# Altium project LMP91000 BLE.PrjPcb
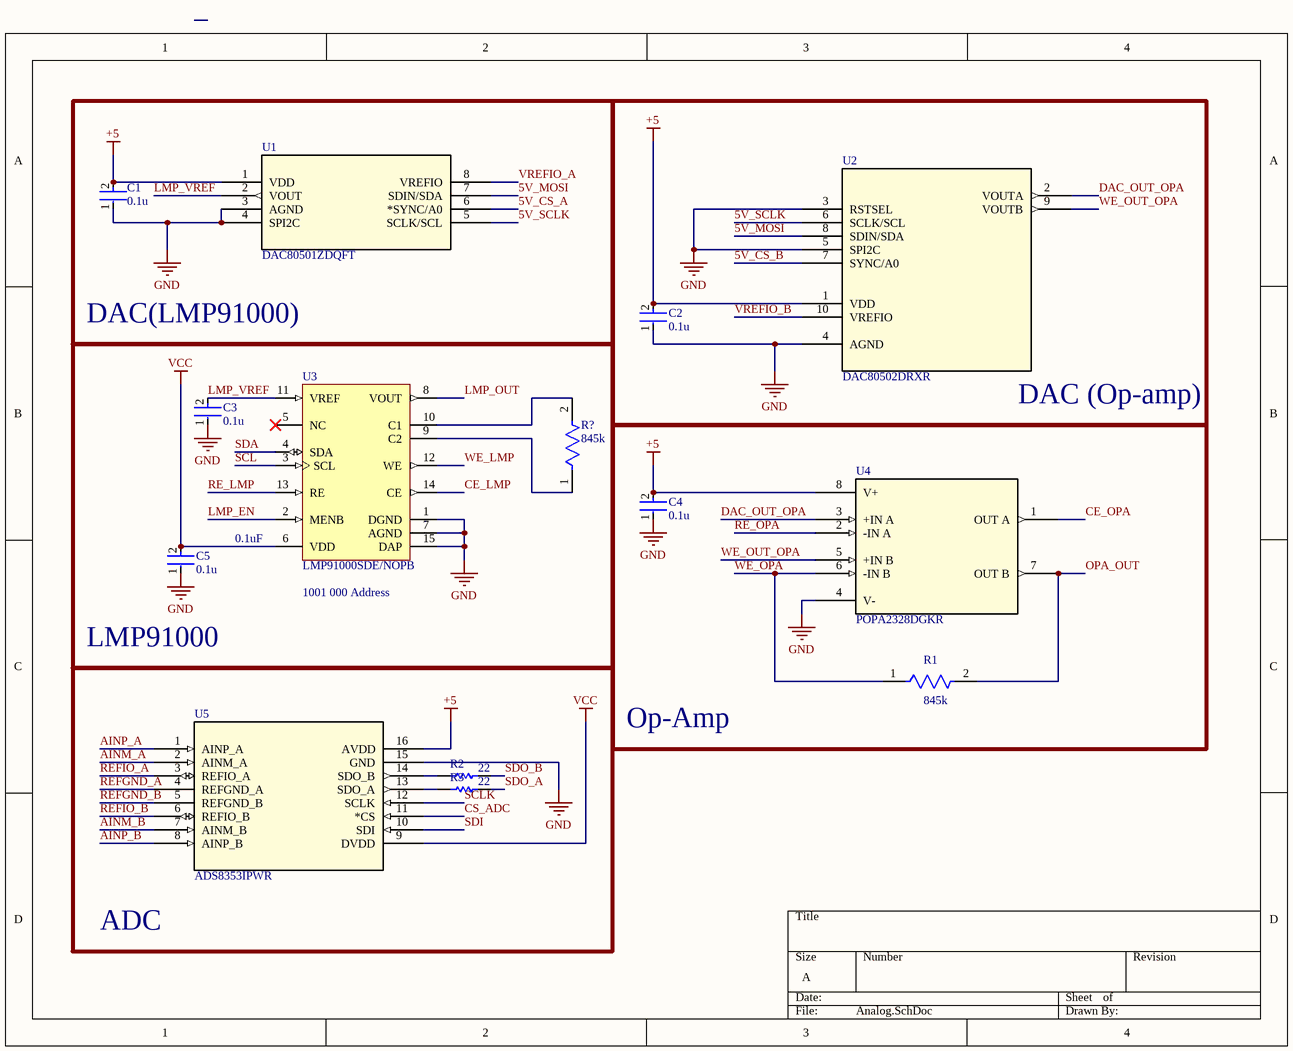
[diagram p0: Analog.SchDoc]
3 sheets, 34 parts. Net scope: global (net labels, ports and power ports of the same name join across sheets).
Board file: LMP91000 BLE.PcbDoc
Sheets:
  Analog.SchDoc
  MCU.SchDoc
  Power.SchDoc

## Sheet Analog.SchDoc
size A; SheetNumber: 1; SheetTotal: 4

### Parts
C1  0.1u  [FP-GCJ188-0_2-IPC_C]
C2  0.1u  [FP-GCJ188-0_2-IPC_C]
C3  0.1u  [FP-GCJ188-0_2-IPC_C]
C4  0.1u  [FP-GCJ188-0_2-IPC_C]
C5  0.1u  [FP-GCJ188-0_2-IPC_C]
R1  845k  [FP-CR0603-IPC_B]
R2  22  [RESC1608X55X25LL10T15]
R3  22  [RESC1608X55X25LL10T15]
R?  845k  [FP-CR0603-IPC_B]
U1  DAC80501ZDQFT  [WSON8_2P1X2P1_TEX]
U2  DAC80502DRXR  [SON_02DRXR_TEX]
U3  LMP91000SDE/NOPB  [NHL0014B_V]
U4  POPA2328DGKR  [SO8_DGK_TEX]
U5  ADS8353IPWR  [PW16_TEX]

### Blocks framed on the sheet
DAC(LMP91000): C1 U1
DAC (Op-amp): C2 U2
LMP91000: C3 C5 R? U3
Op-Amp: C4 R1 U4

### Nets
+5: C1.2 C2.2 C4.2 U1.1(VDD) U2.1(VDD) U4.8(V+) U5.16(AVDD)
GND: C1.1 C2.1 C3.1 C4.1 C5.1 U1.3(AGND) U1.4(SPI2C) U2.3(RSTSEL) U2.4(AGND) U2.5(SPI2C) U3.1(DGND) U3.7(AGND) U3.15(DAP) U4.4(V-) U5.15(GND)
VCC: C5.2 U3.6(VDD) U5.9(DVDD)
5V_CS_A: U1.6(*SYNC/A0)
5V_CS_B: U2.7(SYNC/A0)
5V_MOSI: U1.7(SDIN/SDA) U2.8(SDIN/SDA)
5V_SCLK: U1.5(SCLK/SCL) U2.6(SCLK/SCL)
AINM_A: U5.2(AINM_A)
AINM_B: U5.7(AINM_B)
AINP_A: U5.1(AINP_A)
AINP_B: U5.8(AINP_B)
CE_LMP: U3.14(CE)
CE_OPA: U4.1(OUT_A)
CS_ADC: U5.11(*CS)
DAC_OUT_OPA: U2.2(VOUTA) U4.3(+IN_A)
LMP_EN: U3.2(MENB)
LMP_OUT: U3.8(VOUT)
LMP_VREF: C3.2 U1.2(VOUT) U3.11(VREF)
OPA_OUT: R1.2 U4.7(OUT_B)
RE_LMP: U3.13(RE)
RE_OPA: U4.2(-IN_A)
REFGND_A: U5.4(REFGND_A)
REFGND_B: U5.5(REFGND_B)
REFIO_A: U5.3(REFIO_A)
REFIO_B: U5.6(REFIO_B)
SCL: U3.3(SCL)
SCLK: U5.12(SCLK)
SDA: U3.4(SDA)
SDI: U5.10(SDI)
SDO_A: R3.2
SDO_B: R2.2
VREFIO_A: U1.8(VREFIO)
VREFIO_B: U2.10(VREFIO)
WE_LMP: U3.12(WE)
WE_OPA: R1.1 U4.6(-IN_B)
WE_OUT_OPA: U2.9(VOUTB) U4.5(+IN_B)
NetR2_1: R2.1 U5.14(SDO_B)
NetR3_1: R3.1 U5.13(SDO_A)
NetR?_1: R?.1 U3.9(C2)
NetR?_2: R?.2 U3.10(C1)

Not connected (* = marked no-connect by the designer): U3 5(NC)*

### Notes on the sheet
- 0.1uF
- (near U3) 1001 000 Address
- ADC

### Library data of the parts
C1-C5 = CMP-2006-02223-2: Cap Ceramic 0.1uF 50V X7R 10% Pad SMD 0603 Soft Termination +125°C Automotive T/R; Capacitance: 100nF; Radiation Hardening: No; Dielectric: X7R; Voltage Rating (DC): 50V; Case Code (Imperial): 0603; Length: 1.6mm; Features: Soft Termination; Case Code (Metric): 1608; Case/Package: 0603; Termination: SMD/SMT; Packaging: Tape and Reel; Height: 0.8mm; Tolerance: 10%; Thickness: 0.035inch; Width: 0.031inch; Voltage Rating: 50V; Min Operating Temperature: -55°C; Ratings: AEC-Q200; Package Quantity: 1; Depth: 0.8mm; Mount: Surface Mount; Lead Free: Lead Free; Max Operating Temperature: 125°C
R1 R? = CMP-07231-001938-1: Thick Film Chip Resistors 0603 845kΩ 0.1W 1% 100ppm/°C; Voltage Rating: 50V; Power Rating: 100mW; Resistance: 845kR; Contact Plating: Tin; Case/Package: 0603; Tolerance: 1%; Case Code (Metric): 1608; Termination: SMD/SMT; Min Operating Temperature: -55°C; Depth: 0.8mm; Mount: Surface Mount; Max Operating Temperature: 155°C; Thickness: 457um; Military Standard: Not; Height: 0.45mm; Radiation Hardening: No; Length: 1.6mm; Temperature Coefficient: 100ppm/°C; Case Code (Imperial): 0603; Package Quantity: 5000; Width: 0.8mm; Composition: Thick Film; Packaging: Tape and Reel
R2 R3 = CMP-2000-04180-1: Manufacturer: Yageo; Part Number: RC0603FR-1022RL
U1 = DAC80501ZDQFT: True 16-bit, 1-ch, SPI/I2C, voltage-output DAC in WSON package with precision internal reference; Mfr_Name: Texas Instruments; RefDes: RefDes; Type: Type; Supplier 1: Mouser; Supplier Part Number 1: 595-DAC80501ZDQFT
U2 = DAC80502DRXR: Dual-channel, 1-LSB INL, 16-bit, SPI voltage-output digital-to-analog converter (DAC); Mfr_Name: Texas Instruments; RefDes: RefDes; Type: Type; Supplier 1: Digikey; Supplier Part Number 1: 296-DAC80502DRXTCT-ND
U3 = CMP-0064-00201-2: Configurable AFE Potentiostat for Low-Power Chemical Sensing Applications, 14-pin LLP, 250 Reel; Manufacturer: Texas Instruments; PowerWise: N; PackageTopMarking: NS*UZXYTT*L91000; CompType: OtherParts; PackageDescription: LLP, Plastic, Dual, 4 x 4 x 0.8mm Body, 14 Lead, 0.5mm Pitch, No Pullback; ComponentLink1URL: http://www.ti.com/general/docs/lit/getliterature.tsp?genericPartNumber=LMP91000&fileType=pdf; ComponentLink1Description: Datasheet URL; PinCount: 14; RoHS: Y; PackageReference: NHL0014B
U4 = POPA2328DGKR: Dual-channel, precision, 50-µV offset voltage, 40-MHz wide-bandwidth RRIO CMOS op amp; Mfr_Name: Texas Instruments; RefDes: RefDes; Type: Type; Supplier 1: Mouser; Supplier Part Number 1: 595-OPA2328DGKR
U5 = ADS8353IPWR: 16-bit 600-kSPS 2-channel simultaneous-sampling SAR ADC with single-ended inputs; Mfr_Name: Texas Instruments; RefDes: RefDes; Type: Type; Supplier 1: Mouser; Supplier Part Number 1: 595-ADS8353IPWR

## Sheet MCU.SchDoc
size A; SheetNumber: 2; SheetTotal: 4
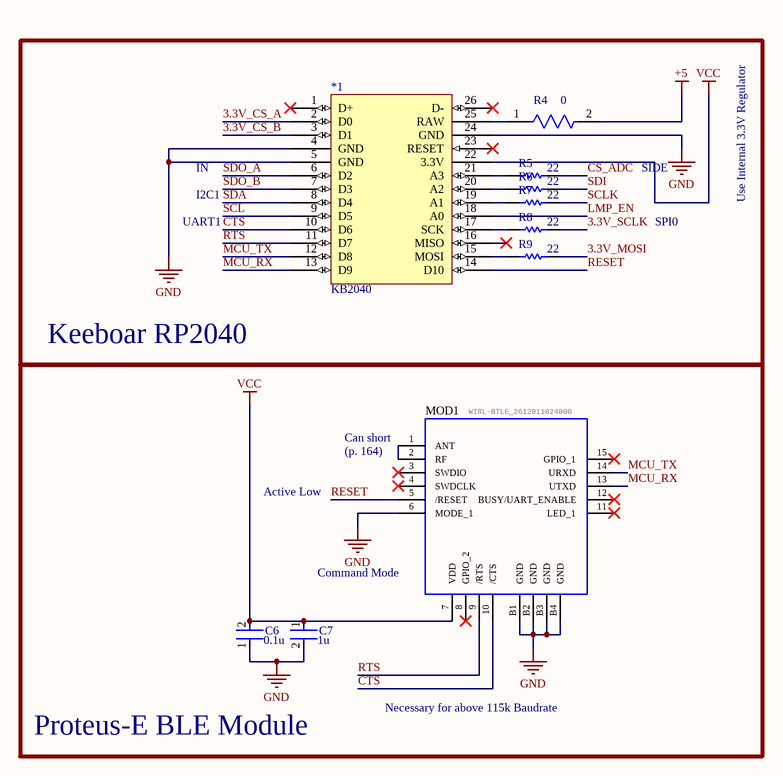
[diagram p1: MCU.SchDoc]

### Parts
*1  KB2040  [CAC-254P3300X1775-26N]
C6  0.1u  [FP-GCJ188-0_2-IPC_C]
C7  1u  [FP-GCM188-0_1-IPC_B]
MOD1  WIRL-BTLE_2612011024000  [WE-FP-6]
R4  0  [FP-CRCW0603-MFG]
R5  22  [RESC1608X55X25LL10T15]
R6  22  [RESC1608X55X25LL10T15]
R7  22  [RESC1608X55X25LL10T15]
R8  22  [RESC1608X55X25LL10T15]
R9  22  [RESC1608X55X25LL10T15]

### Blocks framed on the sheet
Keeboar RP2040: *1 R4-R9
Proteus-E BLE Module: C6 C7 MOD1

### Nets
+5: R4.2
GND: *1.4(GND) *1.5(GND) *1.24(GND) C6.1 C7.2 MOD1.6(MODE_1) MOD1.B1(GND) MOD1.B2(GND) MOD1.B3(GND) MOD1.B4(GND)
VCC: *1.22(3.3V) C6.2 C7.1 MOD1.7(VDD)
3.3V_CS_A: *1.2(D0)
3.3V_CS_B: *1.3(D1)
3.3V_MOSI: R9.2
3.3V_SCLK: R8.2
CS_ADC: R5.2
CTS: *1.10(D6) MOD1.10(/CTS)
LMP_EN: *1.18(A0)
MCU_RX: *1.13(D9) MOD1.13(UTXD)
MCU_TX: *1.12(D8) MOD1.14(URXD)
RESET: *1.14(D10) MOD1.5(/RESET)
RTS: *1.11(D7) MOD1.9(/RTS)
SCL: *1.9(D5)
SCLK: R7.2
SDA: *1.8(D4)
SDI: R6.2
SDO_A: *1.6(D2)
SDO_B: *1.7(D3)
Net*1_15: *1.15(MOSI) R9.1
Net*1_17: *1.17(SCK) R8.1
Net*1_19: *1.19(A1) R7.1
Net*1_20: *1.20(A2) R6.1
Net*1_21: *1.21(A3) R5.1
Net*1_25: *1.25(RAW) R4.1
NetMOD1_1: MOD1.1(ANT) MOD1.2(RF)

Not connected (* = marked no-connect by the designer): *1 1(D+)* 16(MISO)* 23(RESET)* 26(D-)*; MOD1 3(SWDIO)* 4(SWDCLK)* 8(GPIO_2)* 11(LED_1)* 12(BUSY/UART_ENABLE)* 15(GPIO_1)*

### Notes on the sheet
- IN
- I2C1
- SIDE
- Use Internal 3.3V Regulator
- UART1
- SPI0
- (near MOD1) Can short
- (near MOD1) (p. 164)
- Active Low
- Command Mode
- Necessary for above 115k Baudrate

### Library data of the parts
*1 = KB2040-1: Adafruit KB2040 - RP2040 Kee Boar Driver; Adafruit Link: https://www.adafruit.com/product/5302#technical-details
C6 = CMP-2006-02223-2: as C1 on sheet Analog; Radiation Hardening: No; Dielectric: X7R; Voltage Rating (DC): 50V; Case Code (Imperial): 0603; Length: 1.6mm; Features: Soft Termination; Case Code (Metric): 1608; Case/Package: 0603; Termination: SMD/SMT; Packaging: Tape and Reel; Height: 0.8mm; Tolerance: 10%; Thickness: 0.035inch; Width: 0.031inch; Voltage Rating: 50V; Min Operating Temperature: -55°C; Ratings: AEC-Q200; Package Quantity: 1; Depth: 0.8mm; Mount: Surface Mount; Lead Free: Lead Free; Max Operating Temperature: 125°C
C7 = CMP-2006-02357-2: Ceramic Capacitor for Automotive 1uF  ±10% 16VDC X7R 0603 Paper T/R; Voltage: 16V; Thickness: 0.035inch; Width: 0.031inch; Radiation Hardening: No; Depth: 0.8mm; Max Operating Temperature: 125°C; Package Quantity: 1; Ratings: AEC-Q200; Min Operating Temperature: -55°C; Packaging: Tape and Reel; Case Code (Metric): 1608; REACH SVHC: No SVHC; Dielectric: X7R; Case Code (Imperial): 0603; Length: 1.6mm; Height: 0.8mm; Voltage Rating: 16V; Termination: SMD/SMT; Case/Package: 0603; Voltage Rating (DC): 16V; Tolerance: 10%; Capacitance: 1uF; Mount: Surface Mount; Lead Free: Lead Free
MOD1 = WIRL-BTLE_2612011024000: Proteus-e Bluetooth® LE 5.1 Module; RX sensitivity e.r.p: -85; Line of Sight: 350m; Frequency: 2402-2480MHz; Output Power e.r.p: -4dBm; Operating Supply Voltage max.: 3.6V; Operating Supply Voltage min.: 1.8V; Part Number: 2612011024000; Published Date: Jan 2022; Publisher: Würth Elektronik; Operating Temperature: -40 to +85degC; Mounting technology: SMT; Packaging: Tape and reel; ComponentLink1Description: Manufacturer; ComponentLink1URL: http://www.we-online.de; ComponentLink2Description: Datasheet; ComponentLink2URL: https://katalog.we-online.de/wco/datasheet/2612011024000.pdf; Supplier 1: Digikey; Supplier Part Number 1: 732-2612011024000CT-ND
R4 = CMP-02407-011577-1: RES SMD 0 OHM JUMPER 1/10W 0603; Resistance: 0R; Tolerance: 5%; Power Dissipation: 100mW; Voltage Rating (DC): 75V; Temperature Coefficient: 100ppm/°C; Min Operating Temperature: -55°C; RoHS Compliant: No; Military Standard: Not; Case Code (Imperial): 0603; Series: CRCW; Resistor Type: Thick Film; Features: Automotive AEC-Q200; Power Rating: 100mW; Radiation Hardening: No; Case/Package: 0603; Width: 0.033inch; Length: 1.55mm; Case Code (Metric): 1608; Depth: 0.85mm; Package Quantity: 5000; Size Code: 0603; Weight: 7.1E-05oz; Termination: SMD/SMT; Lead Free: Contains Lead; Packaging: Tape and Reel; Contact Plating: Tin; Max Operating Temperature: 155°C; Number of Terminations: 2; Max Power Dissipation: 100mW; Construction: Rectangular; Mount: Surface Mount; Height: 0.02inch; Voltage Rating: 75V
R5-R9 = CMP-2000-04180-1: as R2 on sheet Analog

## Sheet Power.SchDoc
size A; SheetNumber: 3; SheetTotal: 4
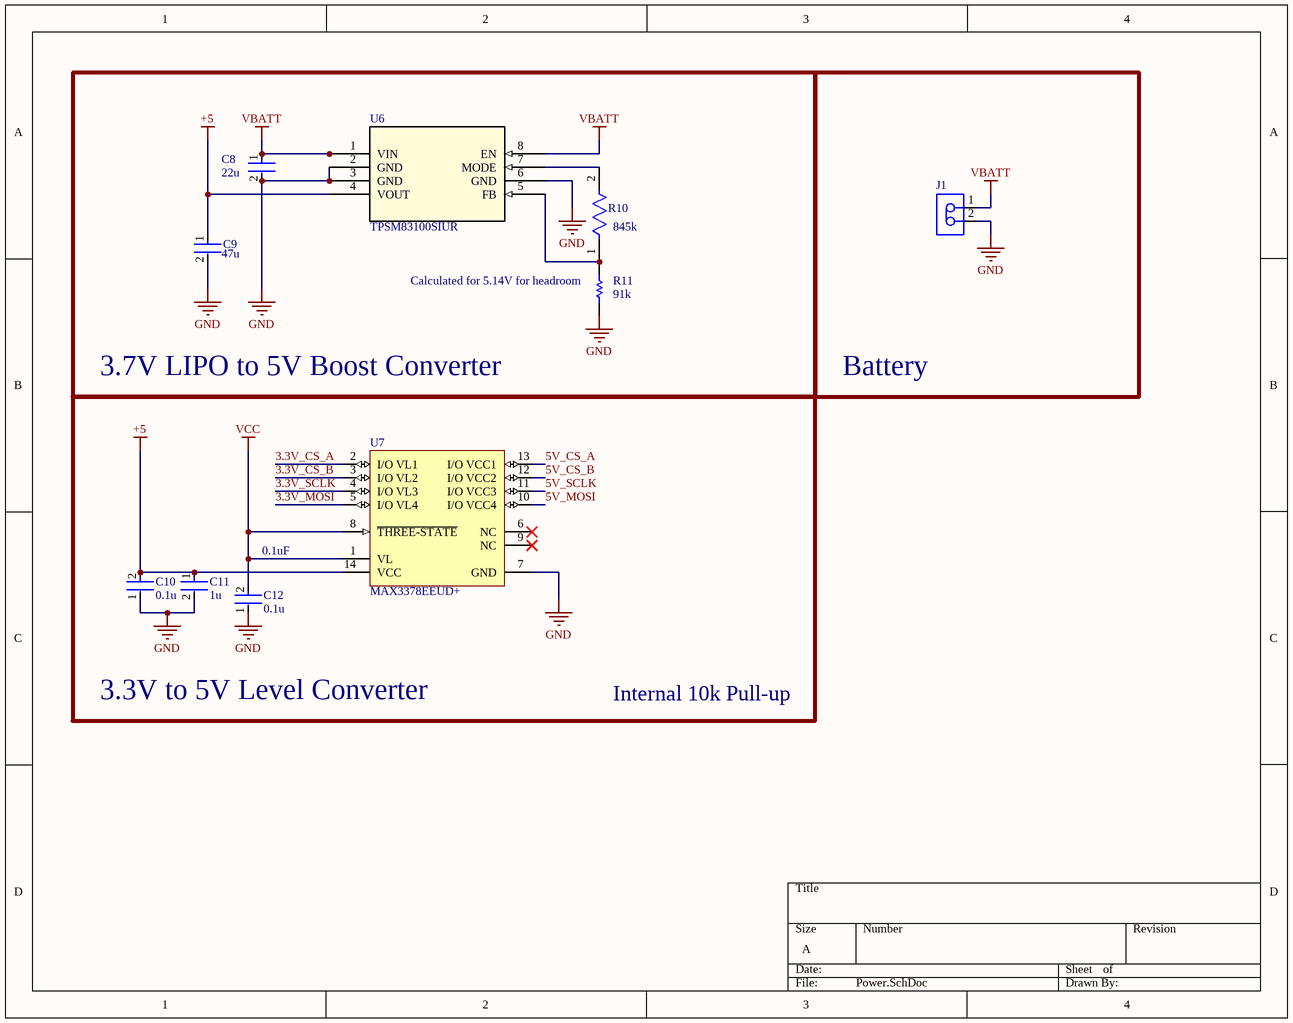
[diagram p2: Power.SchDoc]

### Parts
C8  22u  [FP-GRM187-0_2-IPC_C]
C9  47u  [FP-GRM219-0_2-0_1-IPC_A]
C10  0.1u  [FP-GCJ188-0_2-IPC_C]
C11  1u  [FP-GCM188-0_1-IPC_B]
C12  0.1u  [FP-GCJ188-0_2-IPC_C]
J1  B2B-PH-K-S(LF)(SN)  [JST-B2B-PH-K-S_V]  (value not drawn)
R10  845k  [FP-CR0603-IPC_B]
R11  91k  [RESC1609X50X30NL10T20]
U6  TPSM83100SIUR  [MICROSIP8_SIU_TEX]
U7  MAX3378EEUD+  [MAXM-U14+1_V]

### Blocks framed on the sheet
3.7V LIPO to 5V Boost Converter: C8 C9 R10 R11 U6
Battery: J1
3.3V to 5V Level Converter: C10-C12 U7

### Nets
+5: C9.1 C10.2 C11.1 U6.4(VOUT) U7.14(VCC)
GND: C8.2 C9.2 C10.1 C11.2 C12.1 J1.2 R11.1 U6.2(GND) U6.3(GND) U6.6(GND) U7.7(GND)
VBATT: C8.1 J1.1 U6.1(VIN) U6.8(EN)
VCC: C12.2 U7.1(VL) U7.8(~{THREE-STATE})
3.3V_CS_A: U7.2(I/O_VL1)
3.3V_CS_B: U7.3(I/O_VL2)
3.3V_MOSI: U7.5(I/O_VL4)
3.3V_SCLK: U7.4(I/O_VL3)
5V_CS_A: U7.13(I/O_VCC1)
5V_CS_B: U7.12(I/O_VCC2)
5V_MOSI: U7.10(I/O_VCC4)
5V_SCLK: U7.11(I/O_VCC3)
NetR10_1: R10.1 R11.2 U6.5(FB)
NetR10_2: R10.2 U6.7(MODE)

Not connected (* = marked no-connect by the designer): U7 6(NC)* 9(NC)*

### Notes on the sheet
- (near R11) Calculated for 5.14V for headroom
- (near C12) 0.1uF
- Internal 10k Pull-up

### Library data of the parts
C8 = CMP-06035-049226-1: Chip Multilayer Ceramic Capacitors for General Purpose, 0603, 22uF, X5R, 15%, 20%, 10V; Dielectric: X5R; Capacitance: 22uF; Voltage Rating: 10V; Case/Package: 0603; Case Code (Imperial): 0603; Voltage Rating (DC): 10V; Mount: Surface Mount; Length: 0.063inch; Width: 0.031inch; Max Operating Temperature: 85°C; Thickness: 0.031inch; Tolerance: 20%; Case Code (Metric): 1608; Packaging: Tape and Reel; Min Operating Temperature: -55°C
C9 = CMP-06035-004086-1: Chip Multilayer Ceramic Capacitors for General Purpose, 0805, 47uF, X5R, 15%, 20%, 6.3V; Case Code (Metric): 2012; Voltage Rating: 6.3V; Case Code (Imperial): 0805; Max Operating Temperature: 85°C; Width: 0.049inch; Length: 0.079inch; Min Operating Temperature: -55°C; Mount: Surface Mount; Packaging: Tape and Reel; Case/Package: 0805; Thickness: 0.037inch; Capacitance: 47uF; Tolerance: 20%
C10 C12 = CMP-2006-02223-2: as C1 on sheet Analog; Radiation Hardening: No; Dielectric: X7R; Voltage Rating (DC): 50V; Case Code (Imperial): 0603; Length: 1.6mm; Features: Soft Termination; Case Code (Metric): 1608; Case/Package: 0603; Termination: SMD/SMT; Packaging: Tape and Reel; Height: 0.8mm; Tolerance: 10%; Thickness: 0.035inch; Width: 0.031inch; Voltage Rating: 50V; Min Operating Temperature: -55°C; Ratings: AEC-Q200; Package Quantity: 1; Depth: 0.8mm; Mount: Surface Mount; Lead Free: Lead Free; Max Operating Temperature: 125°C
C11 = CMP-2006-02357-2: as C7 on sheet MCU; Thickness: 0.035inch; Width: 0.031inch; Radiation Hardening: No; Depth: 0.8mm; Max Operating Temperature: 125°C; Package Quantity: 1; Ratings: AEC-Q200; Min Operating Temperature: -55°C; Packaging: Tape and Reel; Case Code (Metric): 1608; REACH SVHC: No SVHC; Dielectric: X7R; Case Code (Imperial): 0603; Length: 1.6mm; Height: 0.8mm; Voltage Rating: 16V; Termination: SMD/SMT; Case/Package: 0603; Voltage Rating (DC): 16V; Tolerance: 10%; Capacitance: 1uF; Mount: Surface Mount; Lead Free: Lead Free
J1 = CMP-2000-05162-1: Male Header, Pitch 2 mm, 1 x 2 Position, Height 6 mm, Tail Length 3.4 mm, -25 to 85 degC, RoHS, Bulk; Manufacturer: JST; Pitch: 2mm; Style/Orientation: StraightHeader/Plug; No of Positions: 2; Datasheet Version: Nov-08; Datasheet URL: http://datasheet.octopart.com/B2B-PH-K-S%28LF%29%28SN%29-JST-datasheet-8324864.pdf; Manufacturer URL: http://www.jst.com/home2.html; Type: ShroudedHeader; Termination: Crimp
R10 = CMP-07231-001938-1: as R1 on sheet Analog; Contact Plating: Tin; Case/Package: 0603; Tolerance: 1%; Case Code (Metric): 1608; Termination: SMD/SMT; Min Operating Temperature: -55°C; Depth: 0.8mm; Mount: Surface Mount; Max Operating Temperature: 155°C; Thickness: 457um; Military Standard: Not; Height: 0.45mm; Radiation Hardening: No; Length: 1.6mm; Temperature Coefficient: 100ppm/°C; Case Code (Imperial): 0603; Package Quantity: 5000; Width: 0.8mm; Composition: Thick Film; Packaging: Tape and Reel
R11 = CMP-2000-03640-1: Part Number: CRCW060391K0FKEA; Manufacturer: Vishay Dale
U6 = TPSM83100SIUR: 1.5-A high efficiency buck-boost module with integrated inductor; Mfr_Name: Texas Instruments; Type: Power Management; RefDes: RefDes; Supplier 1: Mouser; Supplier Part Number 1: 595-TPSM83100SIUR
U7 = CMP-1703-00001-3: +/-15 kV ESD-Protected, 1 uA, 8 Mbps, Quad Low-Voltage Level Translator in UCSP, 1.65 to 5.5 V, -40 to 85 degC, 14-Pin TSSOP (U14+1), RoHS, Tube; Channels: 4; Min Supply Voltage: 1.65 V; Max Supply Voltage: 5.5 V; Max Ouput Current: -20 uA; Output Current: 1 mA; Case/Package: TSSOP; DatasheetVersion: Rev. 3; Inputs: 4; Max Operating Temperature: 85 degC; ComponentLink3URL: http://pdfserv.maximintegrated.com/package_dwgs/21-0066.PDF; Mount: Surface Mount; Weight: 0.004949 oz; Code_JEDEC: MO-153; ComponentLink3Description: Package Specification; Packaging: Rail/Tube; Pins: 14; REACH SVHC: No SVHC; Package Quantity: 96; PartNumber: MAX3378EEUD+; Width: 4.5 mm; ComponentLink1Description: Manufacturer URL; Height: 0.95 mm; ComponentLink2URL: https://datasheets.maximintegrated.com/en/ds/MAX3372E-MAX3393E.pdf; Radiation Hardening: No; Length: 5.1 mm; PackageDescription: 14-Pin Thin Shrink Small-Outline Package (U14+1), Body 5 x 4.4 mm, Pitch 0.65 mm; RoHSCompliant: True; Min Operating Temperature: -40 degC; Mounting Technology: Surface Mount; ComponentLink2Description: Datasheet; ComponentLink1URL: http://www.maximintegrated.com/

## Nets that join several sheets
+5: Analog (7 pins), MCU (R4.2), Power (5 pins)
GND: Analog (15 pins), MCU (10 pins), Power (11 pins)
VCC: Analog (C5.2 U3.6 U5.9), MCU (*1.22 C6.2 C7.1 MOD1.7), Power (C12.2 U7.1 U7.8)
3.3V_CS_A: MCU (*1.2), Power (U7.2)
3.3V_CS_B: MCU (*1.3), Power (U7.3)
3.3V_MOSI: MCU (R9.2), Power (U7.5)
3.3V_SCLK: MCU (R8.2), Power (U7.4)
5V_CS_A: Analog (U1.6), Power (U7.13)
5V_CS_B: Analog (U2.7), Power (U7.12)
5V_MOSI: Analog (U1.7 U2.8), Power (U7.10)
5V_SCLK: Analog (U1.5 U2.6), Power (U7.11)
CS_ADC: Analog (U5.11), MCU (R5.2)
LMP_EN: Analog (U3.2), MCU (*1.18)
SCL: Analog (U3.3), MCU (*1.9)
SCLK: Analog (U5.12), MCU (R7.2)
SDA: Analog (U3.4), MCU (*1.8)
SDI: Analog (U5.10), MCU (R6.2)
SDO_A: Analog (R3.2), MCU (*1.6)
SDO_B: Analog (R2.2), MCU (*1.7)